# Altium schematic sheet I2C switch.SchDoc
size A4
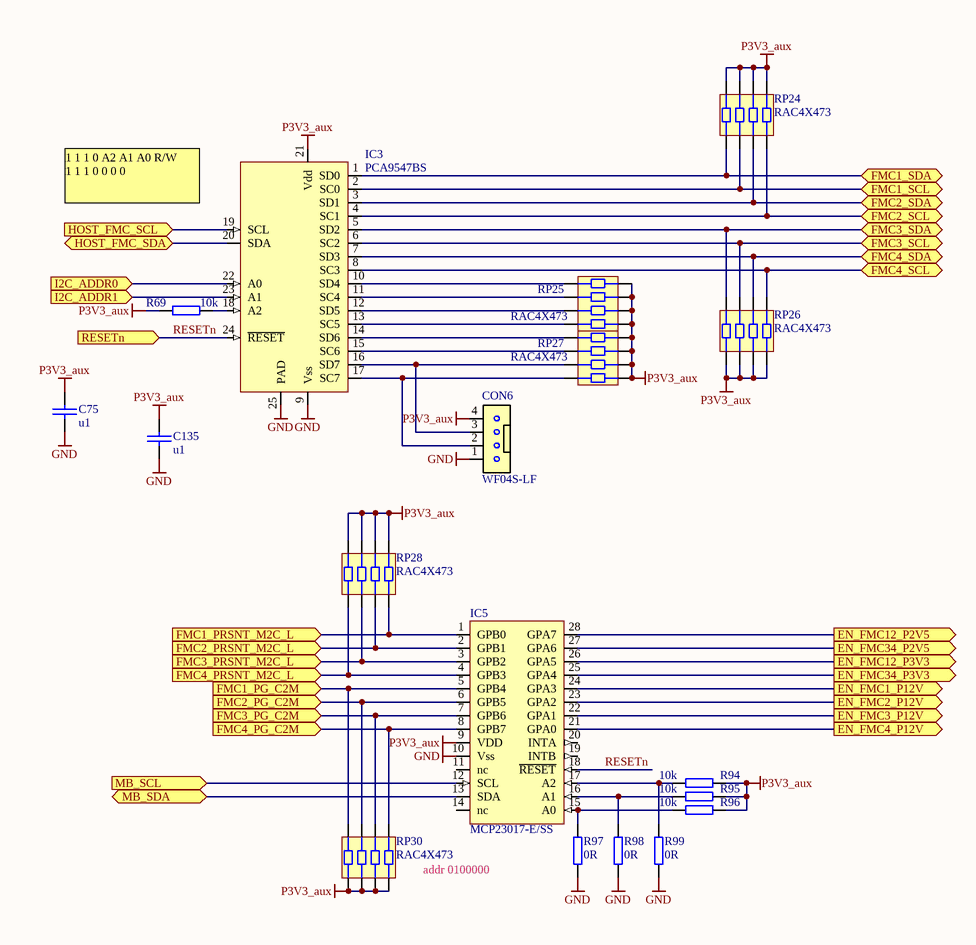
[diagram p0: I2C switch.SchDoc]

## Parts
C75  u1  [0402C]
C135  u1  [0402C]
CON6  WF04S-LF  [CON_WF04S-LF]
IC3  PCA9547BS  [HVQFN24]
IC5  MCP23017-E/SS  [SSOP28]
R69  10k  [0402R]
R94  10k  [0402R]
R95  10k  [0402R]
R96  10k  [0402R]
R97  0R  [0603R]
R98  0R  [0603R]
R99  0R  [0603R]
RP24  RAC4X473  [CAY-16]
RP25  RAC4X473  [CAY-16]
RP26  RAC4X473  [CAY-16]
RP27  RAC4X473  [CAY-16]
RP28  RAC4X473  [CAY-16]
RP30  RAC4X473  [CAY-16]

## Ports
EN_FMC1_P12V (out), EN_FMC2_P12V (out), EN_FMC3_P12V (out), EN_FMC4_P12V (out), EN_FMC12_P2V5 (out), EN_FMC12_P3V3 (out), EN_FMC34_P2V5 (out), EN_FMC34_P3V3 (out), FMC1_PG_C2M (in), FMC1_PRSNT_M2C_L (in), FMC1_SCL (bidir), FMC1_SDA (bidir), FMC2_PG_C2M (in), FMC2_PRSNT_M2C_L (in), FMC2_SCL (bidir), FMC2_SDA (bidir), FMC3_PG_C2M (in), FMC3_PRSNT_M2C_L (in), FMC3_SCL (bidir), FMC3_SDA (bidir), FMC4_PG_C2M (in), FMC4_PRSNT_M2C_L (in), FMC4_SCL (bidir), FMC4_SDA (bidir), HOST_FMC_SCL (in), HOST_FMC_SDA (bidir), I2C_ADDR0 (in), I2C_ADDR1 (in), MB_SCL (in), MB_SDA (bidir), RESETn (in)

## Nets
GND: C75.2 C135.2 CON6.1 IC3.9(Vss) IC3.25(PAD) IC5.10(Vss) R97.1 R98.1 R99.1
P3V3_aux: C75.1 C135.1 CON6.4 IC3.21(Vdd) IC5.9(VDD) R69.1 R94.2 R95.2 R96.2 RP24.1 RP24.2 RP24.3 RP24.4 RP25.5 RP25.6 RP25.7 RP25.8 RP26.1 RP26.2 RP26.3 RP26.4 RP27.5 RP27.6 RP27.7 RP27.8 RP28.5 RP28.6 RP28.7 RP28.8 RP30.5 RP30.6 RP30.7 RP30.8
EN_FMC1_P12V: IC5.24(GPA3) ; port EN_FMC1_P12V
EN_FMC2_P12V: IC5.23(GPA2) ; port EN_FMC2_P12V
EN_FMC3_P12V: IC5.22(GPA1) ; port EN_FMC3_P12V
EN_FMC4_P12V: IC5.21(GPA0) ; port EN_FMC4_P12V
EN_FMC12_P2V5: IC5.28(GPA7) ; port EN_FMC12_P2V5
EN_FMC12_P3V3: IC5.26(GPA5) ; port EN_FMC12_P3V3
EN_FMC34_P2V5: IC5.27(GPA6) ; port EN_FMC34_P2V5
EN_FMC34_P3V3: IC5.25(GPA4) ; port EN_FMC34_P3V3
FMC1_PG_C2M: IC5.5(GPB4) RP30.4 ; port FMC1_PG_C2M
FMC1_PRSNT_M2C_L: IC5.1(GPB0) RP28.4 ; port FMC1_PRSNT_M2C_L
FMC1_SCL: IC3.2(SC0) RP24.7 ; port FMC1_SCL
FMC1_SDA: IC3.1(SD0) RP24.8 ; port FMC1_SDA
FMC2_PG_C2M: IC5.6(GPB5) RP30.3 ; port FMC2_PG_C2M
FMC2_PRSNT_M2C_L: IC5.2(GPB1) RP28.3 ; port FMC2_PRSNT_M2C_L
FMC2_SCL: IC3.4(SC1) RP24.5 ; port FMC2_SCL
FMC2_SDA: IC3.3(SD1) RP24.6 ; port FMC2_SDA
FMC3_PG_C2M: IC5.7(GPB6) RP30.2 ; port FMC3_PG_C2M
FMC3_PRSNT_M2C_L: IC5.3(GPB2) RP28.2 ; port FMC3_PRSNT_M2C_L
FMC3_SCL: IC3.6(SC2) RP26.7 ; port FMC3_SCL
FMC3_SDA: IC3.5(SD2) RP26.8 ; port FMC3_SDA
FMC4_PG_C2M: IC5.8(GPB7) RP30.1 ; port FMC4_PG_C2M
FMC4_PRSNT_M2C_L: IC5.4(GPB3) RP28.1 ; port FMC4_PRSNT_M2C_L
FMC4_SCL: IC3.8(SC3) RP26.5 ; port FMC4_SCL
FMC4_SDA: IC3.7(SD3) RP26.6 ; port FMC4_SDA
HOST_FMC_SCL: IC3.19(SCL) ; port HOST_FMC_SCL
HOST_FMC_SDA: IC3.20(SDA) ; port HOST_FMC_SDA
I2C_ADDR0: IC3.22(A0) ; port I2C_ADDR0
I2C_ADDR1: IC3.23(A1) ; port I2C_ADDR1
MB_SCL: IC5.12(SCL) ; port MB_SCL
MB_SDA: IC5.13(SDA) ; port MB_SDA
RESETn: IC3.24(~{RESET}) IC5.18(~{RESET}) ; port RESETn
NetCON6_2: CON6.2 IC3.17(SC7) RP27.1
NetCON6_3: CON6.3 IC3.16(SD7) RP27.2
NetIC3_10: IC3.10(SD4) RP25.4
NetIC3_11: IC3.11(SC4) RP25.3
NetIC3_12: IC3.12(SD5) RP25.2
NetIC3_13: IC3.13(SC5) RP25.1
NetIC3_14: IC3.14(SD6) RP27.4
NetIC3_15: IC3.15(SC6) RP27.3
NetIC3_18: IC3.18(A2) R69.2
NetIC5_15: IC5.15(A0) R96.1 R97.2
NetIC5_16: IC5.16(A1) R95.1 R98.2
NetIC5_17: IC5.17(A2) R94.1 R99.2

Not connected (* = marked no-connect by the designer): IC5 11(nc) 14(nc) 19(INTB) 20(INTA)

## Notes on the sheet
- (near IC3) 1 1 1 0 A2 A1 A0 R/W
  1 1 1 0 0 0 0
- addr 0100000

## Library data of the parts
C75 C135 = CAP_SMD: Capacitor SMD
CON6 = CON_4_2.54_key
IC3 = IIC_MUX_PCA9547: 8-channel I2C-bus multiplexer with reset
IC5 = IIC_MCP23017: 16 bit I2C expander
R69 R97-R99 = RES_0402: SMD Resistor
R94-R96 = RES_0603: SMD Resistor
RP24-RP28 RP30 = RES_ARRAY_1206: Resistor network 1206 (4x0402) Maritex RAC4Xxxx